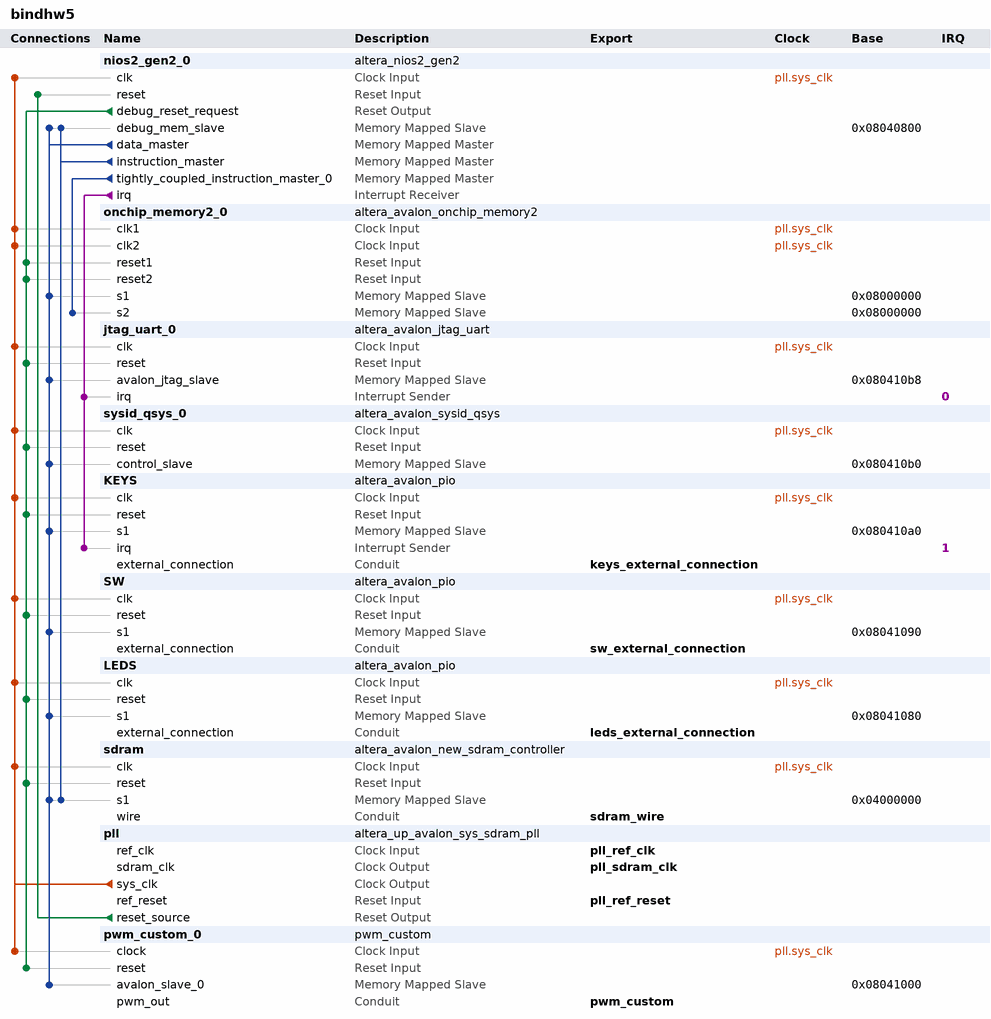
[diagram p0: system contents]
# Platform Designer (Qsys) system bindhw5, Cyclone V 5CSEMA5F31C6
# Parameters at their usual value, and those the tool derives, are not listed.
package require -exact qsys 18.1
create_system bindhw5
set_project_property DEVICE_FAMILY {Cyclone V}
set_project_property DEVICE 5CSEMA5F31C6

add_instance nios2_gen2_0 altera_nios2_gen2 18.1
set_instance_parameter_value nios2_gen2_0 dcache_size 2048
set_instance_parameter_value nios2_gen2_0 exceptionSlave sdram.s1
set_instance_parameter_value nios2_gen2_0 icache_numTCIM 1
set_instance_parameter_value nios2_gen2_0 icache_size 4096
set_instance_parameter_value nios2_gen2_0 impl Fast
set_instance_parameter_value nios2_gen2_0 resetSlave sdram.s1

add_instance onchip_memory2_0 altera_avalon_onchip_memory2 18.1
set_instance_parameter_value onchip_memory2_0 dataWidth 32
set_instance_parameter_value onchip_memory2_0 dualPort true
set_instance_parameter_value onchip_memory2_0 enableDiffWidth true
set_instance_parameter_value onchip_memory2_0 initMemContent true
set_instance_parameter_value onchip_memory2_0 initializationFileName onchip_mem.hex
set_instance_parameter_value onchip_memory2_0 memorySize 131076

add_instance jtag_uart_0 altera_avalon_jtag_uart 18.1
set_instance_parameter_value jtag_uart_0 simInteractiveOptions NO_INTERACTIVE_WINDOWS

add_instance sysid_qsys_0 altera_avalon_sysid_qsys 18.1
set_instance_parameter_value sysid_qsys_0 id 0

add_instance KEYS altera_avalon_pio 18.1
set_instance_parameter_value KEYS captureEdge true
set_instance_parameter_value KEYS direction Input
set_instance_parameter_value KEYS generateIRQ true
set_instance_parameter_value KEYS irqType EDGE
set_instance_parameter_value KEYS width 4

add_instance SW altera_avalon_pio 18.1
set_instance_parameter_value SW direction Input
set_instance_parameter_value SW width 10

add_instance LEDS altera_avalon_pio 18.1
set_instance_parameter_value LEDS direction Output
set_instance_parameter_value LEDS width 10

add_instance sdram altera_avalon_new_sdram_controller 18.1
set_instance_parameter_value sdram TAC 5.4
set_instance_parameter_value sdram TRCD 15.0
set_instance_parameter_value sdram TRP 15.0
set_instance_parameter_value sdram casLatency 3
set_instance_parameter_value sdram columnWidth 10
set_instance_parameter_value sdram dataWidth 16
set_instance_parameter_value sdram generateSimulationModel false
set_instance_parameter_value sdram model single_Micron_MT48LC4M32B2_7_chip
set_instance_parameter_value sdram numberOfBanks 4
set_instance_parameter_value sdram numberOfChipSelects 1
set_instance_parameter_value sdram powerUpDelay 100.0
set_instance_parameter_value sdram refreshPeriod 7.8125
set_instance_parameter_value sdram rowWidth 13

add_instance pll altera_up_avalon_sys_sdram_pll 18.0
set_instance_parameter_value pll CV_boards DE1-SoC
set_instance_parameter_value pll gui_outclk 100.0
set_instance_parameter_value pll gui_refclk 50.0

add_instance pwm_custom_0 pwm_custom 1.0

# connections
add_connection pll.sys_clk jtag_uart_0.clk clock
add_connection pll.sys_clk KEYS.clk clock
add_connection pll.sys_clk LEDS.clk clock
add_connection pll.sys_clk nios2_gen2_0.clk clock
add_connection pll.sys_clk onchip_memory2_0.clk1 clock
add_connection pll.sys_clk onchip_memory2_0.clk2 clock
add_connection pll.sys_clk pwm_custom_0.clock clock
add_connection pll.sys_clk sdram.clk clock
add_connection pll.sys_clk SW.clk clock
add_connection pll.sys_clk sysid_qsys_0.clk clock
add_connection nios2_gen2_0.debug_reset_request jtag_uart_0.reset reset
add_connection nios2_gen2_0.debug_reset_request KEYS.reset reset
add_connection nios2_gen2_0.debug_reset_request LEDS.reset reset
add_connection nios2_gen2_0.debug_reset_request onchip_memory2_0.reset1 reset
add_connection nios2_gen2_0.debug_reset_request onchip_memory2_0.reset2 reset
add_connection nios2_gen2_0.debug_reset_request pwm_custom_0.reset reset
add_connection nios2_gen2_0.debug_reset_request sdram.reset reset
add_connection nios2_gen2_0.debug_reset_request SW.reset reset
add_connection nios2_gen2_0.debug_reset_request sysid_qsys_0.reset reset
add_connection pll.reset_source nios2_gen2_0.reset reset
add_connection nios2_gen2_0.data_master jtag_uart_0.avalon_jtag_slave avalon
set_connection_parameter_value nios2_gen2_0.data_master/jtag_uart_0.avalon_jtag_slave baseAddress 0x080410b8
add_connection nios2_gen2_0.data_master KEYS.s1 avalon
set_connection_parameter_value nios2_gen2_0.data_master/KEYS.s1 baseAddress 0x080410a0
add_connection nios2_gen2_0.data_master LEDS.s1 avalon
set_connection_parameter_value nios2_gen2_0.data_master/LEDS.s1 baseAddress 0x08041080
add_connection nios2_gen2_0.data_master nios2_gen2_0.debug_mem_slave avalon
set_connection_parameter_value nios2_gen2_0.data_master/nios2_gen2_0.debug_mem_slave baseAddress 0x08040800
add_connection nios2_gen2_0.data_master onchip_memory2_0.s1 avalon
set_connection_parameter_value nios2_gen2_0.data_master/onchip_memory2_0.s1 baseAddress 0x08000000
add_connection nios2_gen2_0.data_master pwm_custom_0.avalon_slave_0 avalon
set_connection_parameter_value nios2_gen2_0.data_master/pwm_custom_0.avalon_slave_0 baseAddress 0x08041000
add_connection nios2_gen2_0.data_master sdram.s1 avalon
set_connection_parameter_value nios2_gen2_0.data_master/sdram.s1 baseAddress 0x04000000
add_connection nios2_gen2_0.data_master SW.s1 avalon
set_connection_parameter_value nios2_gen2_0.data_master/SW.s1 baseAddress 0x08041090
add_connection nios2_gen2_0.data_master sysid_qsys_0.control_slave avalon
set_connection_parameter_value nios2_gen2_0.data_master/sysid_qsys_0.control_slave baseAddress 0x080410b0
add_connection nios2_gen2_0.instruction_master nios2_gen2_0.debug_mem_slave avalon
set_connection_parameter_value nios2_gen2_0.instruction_master/nios2_gen2_0.debug_mem_slave baseAddress 0x08040800
add_connection nios2_gen2_0.instruction_master sdram.s1 avalon
set_connection_parameter_value nios2_gen2_0.instruction_master/sdram.s1 baseAddress 0x04000000
add_connection nios2_gen2_0.tightly_coupled_instruction_master_0 onchip_memory2_0.s2 avalon
set_connection_parameter_value nios2_gen2_0.tightly_coupled_instruction_master_0/onchip_memory2_0.s2 baseAddress 0x08000000
add_connection nios2_gen2_0.irq jtag_uart_0.irq interrupt
set_connection_parameter_value nios2_gen2_0.irq/jtag_uart_0.irq irqNumber 0
add_connection nios2_gen2_0.irq KEYS.irq interrupt
set_connection_parameter_value nios2_gen2_0.irq/KEYS.irq irqNumber 1

# exported interfaces
add_interface keys_external_connection conduit end
set_interface_property keys_external_connection EXPORT_OF KEYS.external_connection
add_interface leds_external_connection conduit end
set_interface_property leds_external_connection EXPORT_OF LEDS.external_connection
add_interface pll_ref_clk clock sink
set_interface_property pll_ref_clk EXPORT_OF pll.ref_clk
add_interface pll_ref_reset reset sink
set_interface_property pll_ref_reset EXPORT_OF pll.ref_reset
add_interface pll_sdram_clk clock source
set_interface_property pll_sdram_clk EXPORT_OF pll.sdram_clk
add_interface pwm_custom conduit end
set_interface_property pwm_custom EXPORT_OF pwm_custom_0.pwm_out
add_interface sdram_wire conduit end
set_interface_property sdram_wire EXPORT_OF sdram.wire
add_interface sw_external_connection conduit end
set_interface_property sw_external_connection EXPORT_OF SW.external_connection

set_interconnect_requirement {$system} qsys_mm.clockCrossingAdapter HANDSHAKE
set_interconnect_requirement {$system} qsys_mm.enableEccProtection FALSE
set_interconnect_requirement {$system} qsys_mm.insertDefaultSlave FALSE
set_interconnect_requirement {$system} qsys_mm.maxAdditionalLatency 1

save_system bindhw5.qsys
